# EAGLE schematic RC_RX_CABELL_V3_FHSS (EAGLE 7.5.0)
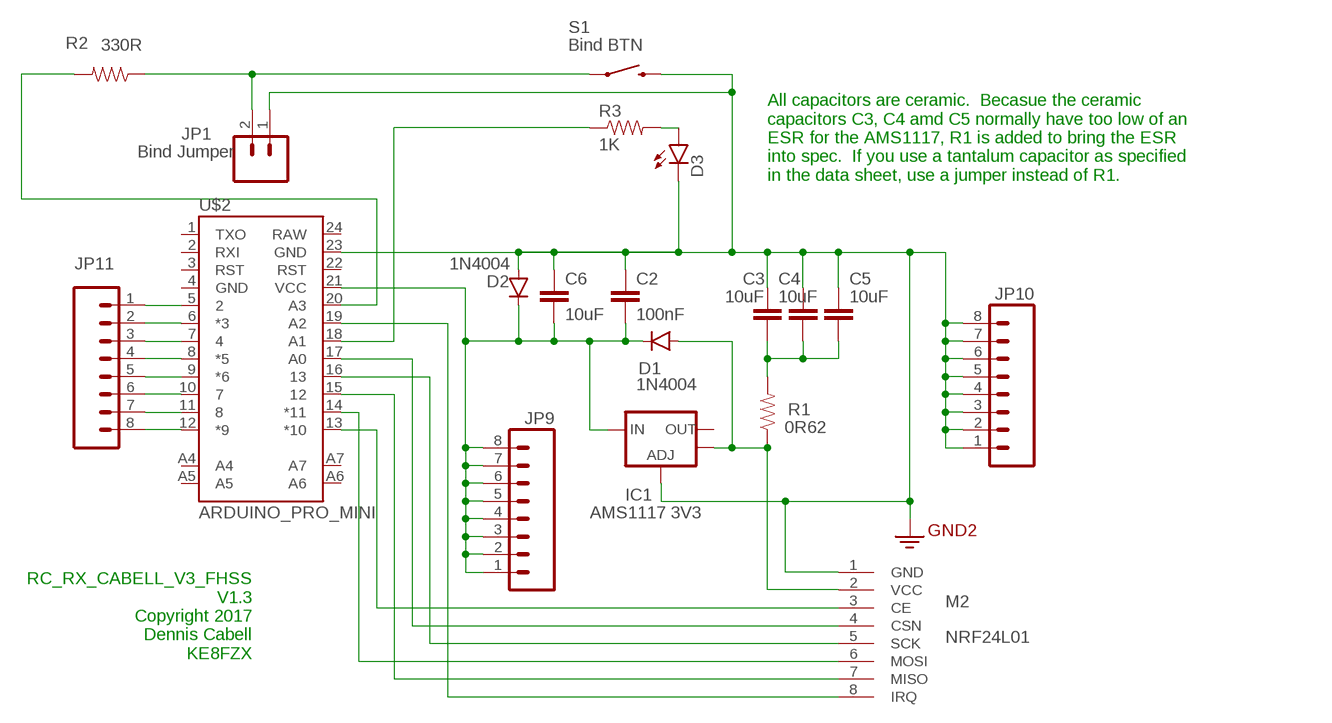
[diagram p0: schematic, sheet 1]

## Parts
C2  100nF  CAPPTH1  [CAP-PTH-5MM]
C3  10uF  CAPPTH1  [CAP-PTH-5MM]
C4  10uF  CAPPTH1  [CAP-PTH-5MM]
C5  10uF  CAPPTH1  [CAP-PTH-5MM]
C6  10uF  CAPPTH1  [CAP-PTH-5MM]
D1  1N4004  DIODEPTH  [DIODE-1N4001]
D2  1N4004  DIODEPTH  [DIODE-1N4001]
D3  LED3MM  [LED3MM]
IC1  AMS1117 3V3  V_REG_LM1117SOT223  [SOT223]
JP1  Bind Jumper  M02PTH  [1X02]
JP9  M08  [1X08_ROUND]
JP10  M08  [1X08_ROUND]
JP11  M08  [1X08_ROUND]
M2  NRF24L01  WIRELESS-NRF24L01  [WIRELESS-NRF24L01]
R1  0R62  RESISTORPTH-1/2W  [AXIAL-0.5]
R2  330R  RESISTORAXIAL-0.3  [AXIAL-0.3]
R3  1K  RESISTORAXIAL-0.3  [AXIAL-0.3]
S1  Bind BTN  SWITCH-MOMENTARY-2SMD-1101NE  [TACTILE-SWITCH-1101NE]
U$2  ARDUINO_PRO_MINI  [ARDUINO_PRO_MINI]

## Nets
5V: C2.2 C6.2 D1.C D2.C IC1.3(IN) JP9.1 JP9.2 JP9.3 JP9.4 JP9.5 JP9.6 JP9.7 JP9.8 U$2.21(VCC)
GND: C2.1 C3.1 C4.1 C5.1 C6.1 D2.A D3.K(C) IC1.1(ADJ) JP1.1 JP10.1 JP10.2 JP10.3 JP10.4 JP10.5 JP10.6 JP10.7 JP10.8 M2.1(GND) S1.2 U$2.23(GND) ; supply symbol labelled GND2
N$1: JP11.1 U$2.5
N$3: M2.3(CE) U$2.13(*10)
N$5: JP11.2 U$2.6(*3)
N$6: JP11.3 U$2.7
N$7: JP11.4 U$2.8(*5)
N$8: JP11.5 U$2.9(*6)
N$9: JP11.6 U$2.10
N$10: JP11.7 U$2.11
N$11: JP11.8 U$2.12(*9)
N$12: JP1.2 R2.P$1 S1.1
N$13: M2.8(IRQ) U$2.19(A2)
N$14: C3.2 C4.2 C5.2 R1.P$2
N$15: M2.5(SCK) U$2.16
N$18: M2.4(CSN) U$2.17(A0)
N$19: D3.A R3.P$2
N$20: M2.6(MOSI) U$2.14(*11)
N$21: R3.P$1 U$2.18(A1)
N$22: M2.7(MISO) U$2.15
N$24: R2.P$2 U$2.20(A3)
VCC: D1.A IC1.4(OUT) M2.2(VCC) R1.P$1
Unconnected: IC1.2(OUT) U$2.1(TXO) U$2.2(RXI) U$2.3(RST) U$2.4(GND) U$2.22(RST) U$2.24(RAW) U$2.A4 U$2.A5 U$2.A6 U$2.A7

## Notes on the sheet
- All capacitors are ceramic.  Becasue the ceramic
  capacitors C3, C4 amd C5 normally have too low of an
  ESR for the AMS1117, R1 is added to bring the ESR
  into spec.  If you use a tantalum capacitor as specified
  in the data sheet, use a jumper instead of R1.
- RC_RX_CABELL_V3_FHSS
  V1.3
  Copyright 2017
  Dennis Cabell
  KE8FZX

## Library data of the parts
C2-C6 = SparkFun-Passives:CAP: Capacitor Standard 0603 ceramic capacitor, and 0.1" leaded capacitor.
D1 D2 = SparkFun-DiscreteSemi:DIODE: Diode These are standard reverse protection diodes and small signal diodes. SMA package can handle up to about 1A. SOD-323 can handle about 200mA. What the SOD-323 package when ordering, there are some mfgs out there that are 5-pin packages.
D3 = SparkFun-LED:LED: LEDs Standard schematic elements and footprints for 5mm, 3mm, 1206, and 0603 sized LEDs. 5mm - Spark Fun Electronics SKU : COM-00529 (and others)
IC1 = SparkFun-PowerIC:V_REG_LM1117: Voltage Regulator LM1117 Standard adjustable voltage regulator but in SMD form. Spark Fun Electronics SKU : COM-00595; PROD_ID: VREG-08170
JP1 = SparkFun-Connectors:M02: Standard 2-pin 0.1" header. Use with - straight break away headers ( PRT-00116) - right angle break away headers (PRT-00553) - swiss pins (PRT-00743) - machine pins (PRT-00117) - female headers (PRT-00115) Molex polarized connector foot print use with: PRT-08233 with associated crimp pins and housings. 2.54_SCREWTERM for use with PRT-10571. 3.5mm Screw Terminal footprints for PRT-08084 5mm Screw Terminal footprints for use with PRT-08432
JP9-JP11 = SparkFun-Connectors:M08: Header 8 Standard 8-pin 0.1" header. Use with straight break away headers (SKU : PRT-00116), right angle break away headers (PRT-00553), swiss pins (PRT-00743), machine pins (PRT-00117), and female headers (PRT-00115).
M2 = diy-modules:WIRELESS-NRF24L01: 2.4 GHz Wireless Module based on NRF24L01 chip
R1-R3 = SparkFun-Passives:RESISTOR: Resistor Basic schematic elements and footprints for 0603, 1206, and PTH resistors.
S1 = SparkFun-Electromechanical:SWITCH-MOMENTARY-2: Various NO switches- pushbuttons, reed, etc; PROD_ID: SWCH-00815
U$2 = SparkFun-Boards:ARDUINO_PRO_MINI